# EAGLE design cnote (EAGLE 9.2.2)
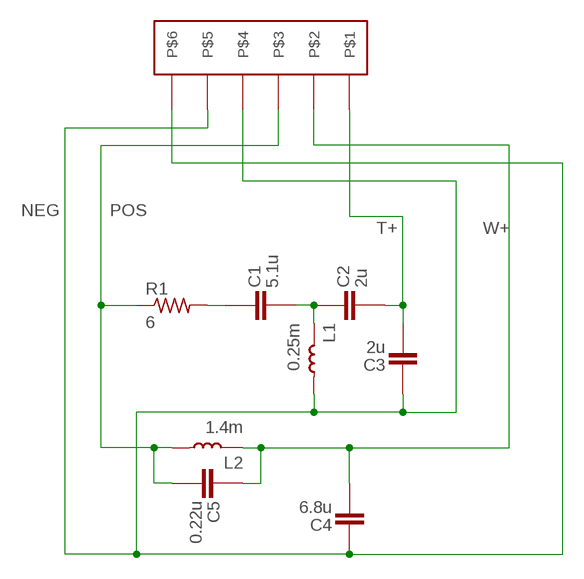
[diagram p0: schematic, sheet 1]

## Parts
C1  5.1u  DAYTON_DMPC-5.1  [DAYTON_21X31]
C2  2u  DAYTON_DMPC-2.0  [DAYTON_13X31]
C3  2u  DAYTON_DMPC-2.0  [DAYTON_13X31]
C4  6.8u  DAYTON_DMPC-6.8  [DAYTON_18X45]
C5  0.22u  DAYTON_DMPC-0.22  [DAYTON_7X18]
L1  0.25m  DAYTON_AC20-25  [DAYTON_AC20-25]
L2  1.4m  DAYTON_AC201-4  [DAYTON_AC201-4]
R1  6  DAYTON_DNR-6.0  [DAYTON_48X10]
U$1  WURTH_WR-TBL-2416-6  [WURTH_WR-TBL-2416-6]

## Nets
N$1: C1.P$2 C2.P$1 L1.P$2
N$2: C1.P$1 R1.P$2
NEG: C3.P$1 C4.P$1 L1.P$1 U$1.P$4 U$1.P$5 U$1.P$6
POS: C5.P$2 L2.P$1 R1.P$1 U$1.P$3
T+: C2.P$2 C3.P$2 U$1.P$1
W+: C4.P$2 C5.P$1 L2.P$2 U$1.P$2

## Library data of the parts
C1 = travis:DAYTON_DMPC-5.1
C2 C3 = travis:DAYTON_DMPC-2.0
C4 = travis:DAYTON_DMPC-6.8
C5 = travis:DAYTON_DMPC-0.22
L1 = travis:DAYTON_AC20-25
L2 = travis:DAYTON_AC201-4
R1 = travis:DAYTON_DNR-6.0
U$1 = travis:WURTH_WR-TBL-2416-6

## Board
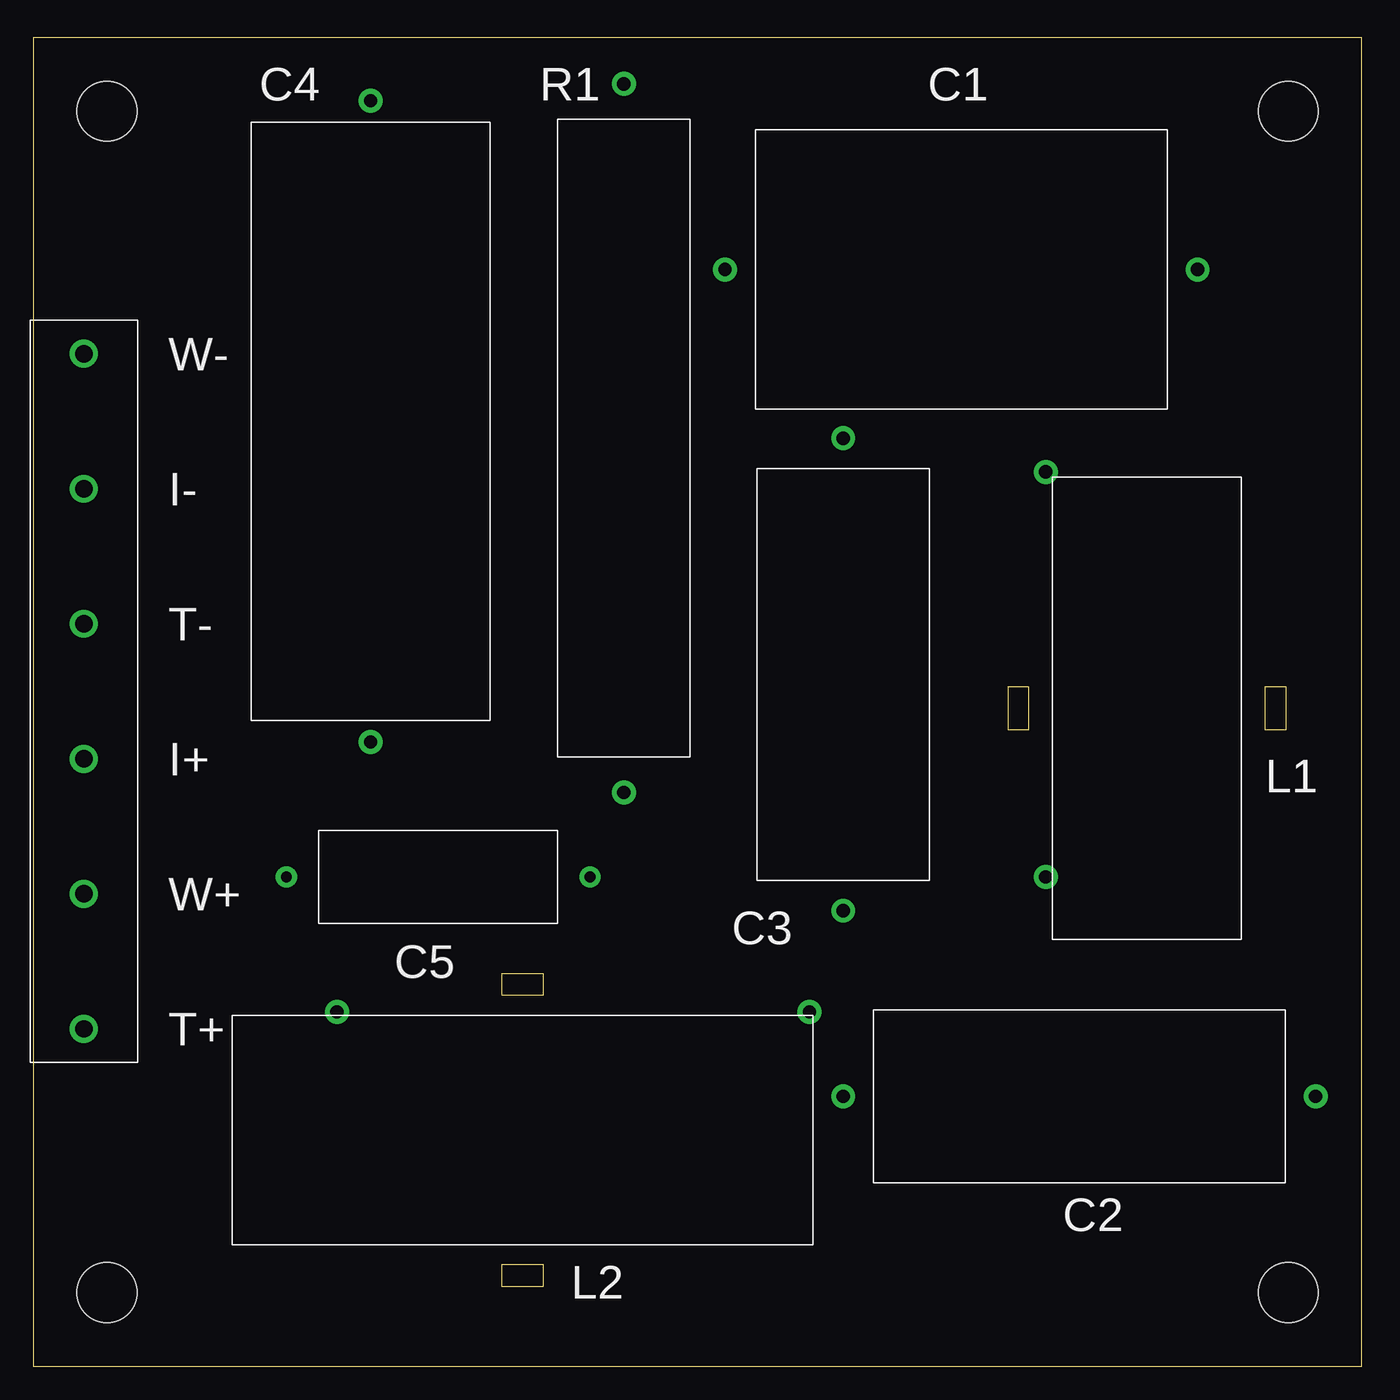
[diagram p1: board, top side]
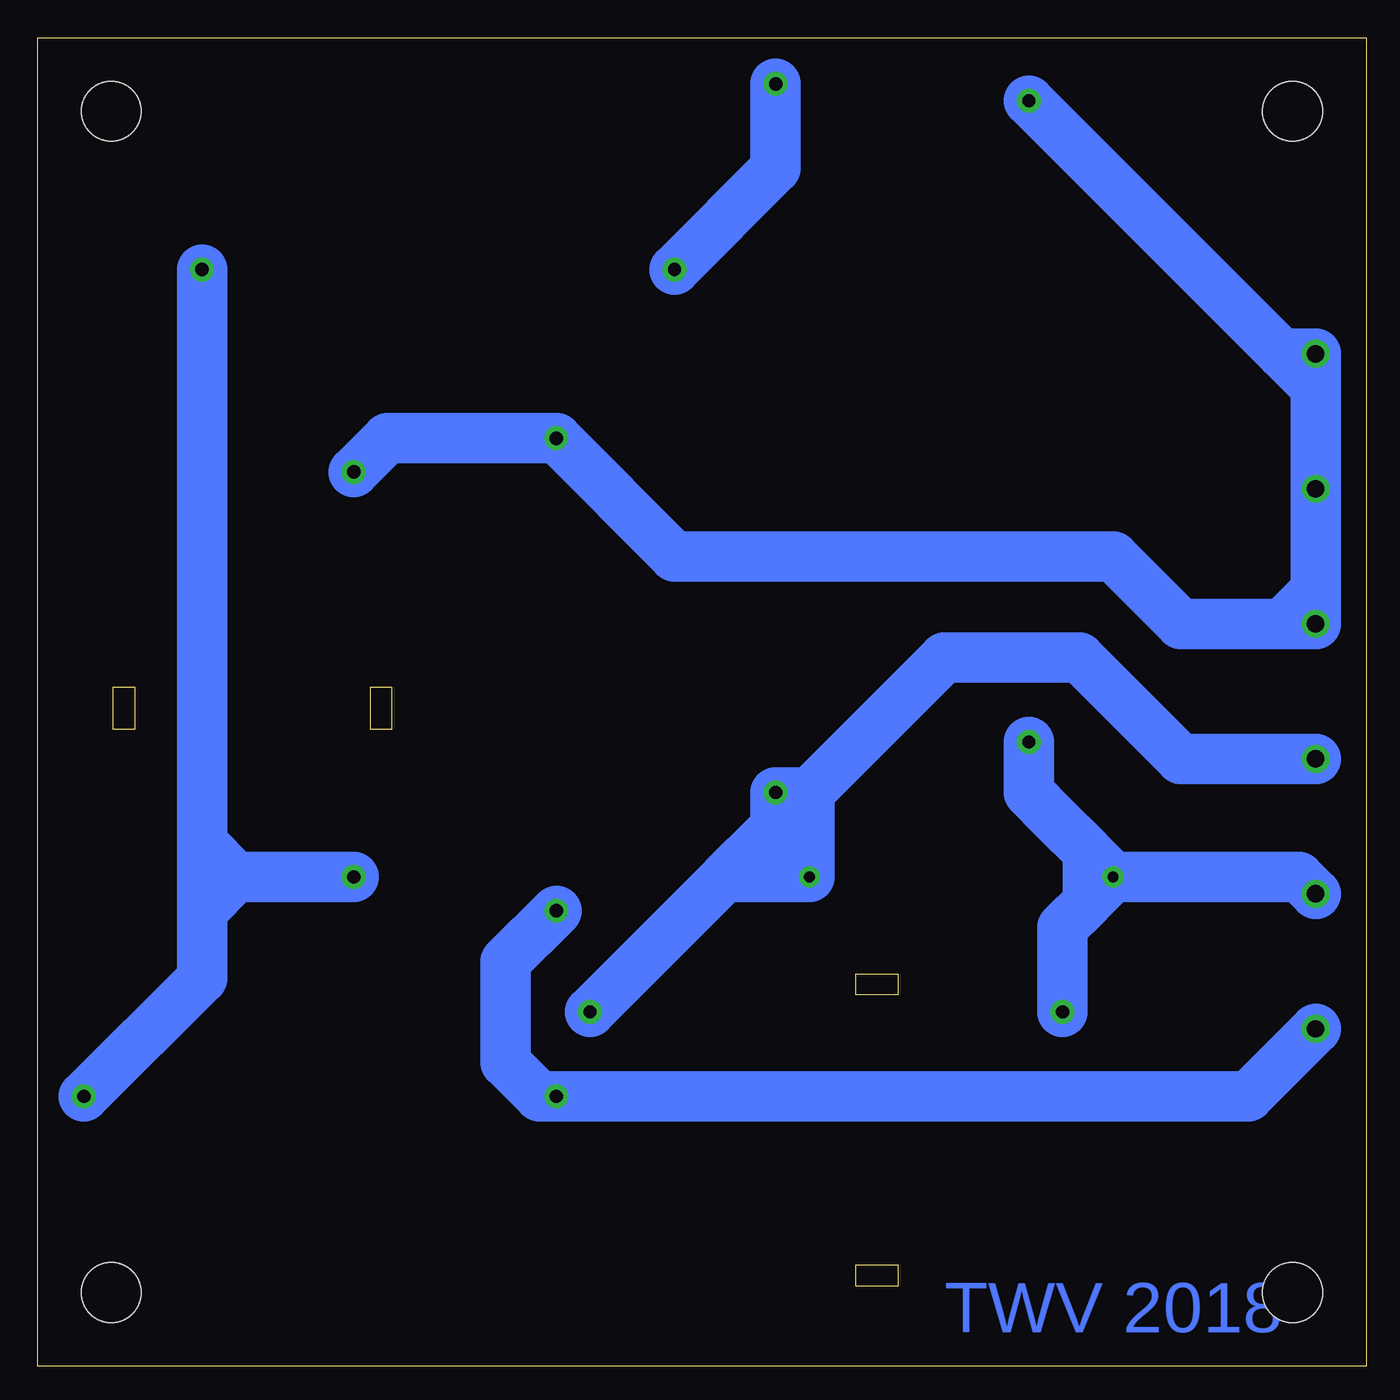
[diagram p2: board, bottom side, seen from below]

Size 100 x 100 mm. Coordinates in mm from the lower left corner, seen from the top.
Outline: 0,0 100,0 100,100 0,100 0,0
Copper layers (1*16): Top 0.035mm / dielectric 1.5mm / Bottom 0.035mm
Design rules "default *": minimum track width 6mil, minimum drill 0.35mm, track to track 20mil, track to pad 20mil, pad to pad 20mil, via to via 20mil, smd to smd 20mil, copper to edge 40mil, drill to drill 20mil, minimum pad ring 10mil, minimum via ring 8mil, stop-mask expansion 4mil, vias tented up to drill 0mil, thermal gap 10mil
Holes 4.5 mm at 5.55,5.55 5.55,94.45 94.45,5.55 94.45,94.45

### Footprints (pad centres in the part's own frame; a part is rotated, then mirrored left to right if it is on the bottom)
DAYTON_21X31 = drill 1 pad 1.8: P$1 -17.78,0; P$2 17.78,0
DAYTON_13X31 = drill 1 pad 1.8: P$1 17.78,0; P$2 -17.78,0
DAYTON_18X45 = drill 1 pad 1.8: P$1 24.13,0; P$2 -24.13,0
DAYTON_7X18 = drill 0.8 pad 1.6: P$1 11.43,0; P$2 -11.43,0
DAYTON_AC20-25 = drill 1 pad 1.8: P$1 -17.78,-7.62; P$2 12.7,-7.62
DAYTON_AC201-4 = drill 1 pad 1.8: P$1 -21.59,-8.89; P$2 13.97,-8.89
DAYTON_48X10 = drill 1 pad 1.8: P$1 26.67,0; P$2 -26.67,0
WURTH_WR-TBL-2416-6 = drill 1.3 pad 2.1: P$1 -25.4,0; P$2 -15.24,0; P$3 -5.08,0; P$4 5.08,0; P$5 15.24,0; P$6 25.4,0

### Placement (x,y rotation side)
C1  69.85,82.55 0 top
C2  78.74,20.32 0 top
C3  60.96,52.07 90 top
C4  25.4,71.12 90 top
C5  30.48,36.83 180 top
L1  83.82,49.53 270 top
L2  36.83,17.78 180 top
R1  44.45,69.85 270 top
U$1  3.81,50.8 90 top

### Tracks (layer width: path | path; a pad name or v marks a point on that pad's centre or on a via)
N$1
  Bottom 3.81: C1.P$2 87.63,39.37 | 87.63,39.37 87.63,36.83 | 87.63,36.83 87.63,34.29 | 87.63,34.29 87.63,29.21 C2.P$1 | L1.P$2 80.01,36.83 85.09,36.83 | 85.09,36.83 87.63,36.83 | 85.09,36.83 87.63,39.37 | 85.09,36.83 87.63,34.29
N$2
  Bottom 3.81: C1.P$1 44.45,90.17 R1.P$2
NEG
  Bottom 3.81: L1.P$1 73.66,69.85 C3.P$1 52.07,60.96 19.05,60.96 13.97,55.88 6.35,55.88 | 3.81,73.66 U$1.P$6 6.35,76.2 | 3.81,73.66 U$1.P$5 3.81,58.42 | 3.81,58.42 U$1.P$4 6.35,55.88 | 6.35,76.2 C4.P$1 | 6.35,76.2 3.81,73.66 | 3.81,58.42 6.35,55.88
POS
  Bottom 3.81: U$1.P$3 13.97,45.72 21.59,53.34 31.75,53.34 41.91,43.18 | L2.P$1 48.26,36.83 | 48.26,36.83 45.09,40.01 | 45.09,40.01 41.91,43.18 | C5.P$2 45.09,40.01 | 41.91,43.18 R1.P$1 44.45,40.64 45.09,40.01 | C5.P$2 41.91,43.18 | C5.P$2 48.26,36.83
T+
  Bottom 3.81: C3.P$2 64.77,30.48 64.77,22.86 62.23,20.32 C2.P$2 8.89,20.32 U$1.P$1
W+
  Bottom 3.81: C4.P$2 25.4,43.18 23.5,41.27 | L2.P$2 22.86,33.02 20.95,34.92 | C5.P$1 20.95,38.73 | 20.95,38.73 23.5,41.27 | C5.P$1 20.95,34.92 | U$1.P$2 5.08,36.83 C5.P$1 | 22.86,40.64 23.5,41.27 | 20.95,38.73 20.95,34.92

### Text on the board
Bottom: TWV 2018
tNames: W- | I- | T- | I+ | W+ | T+
tDocu: Parts Express C-Note Crossover v1.0